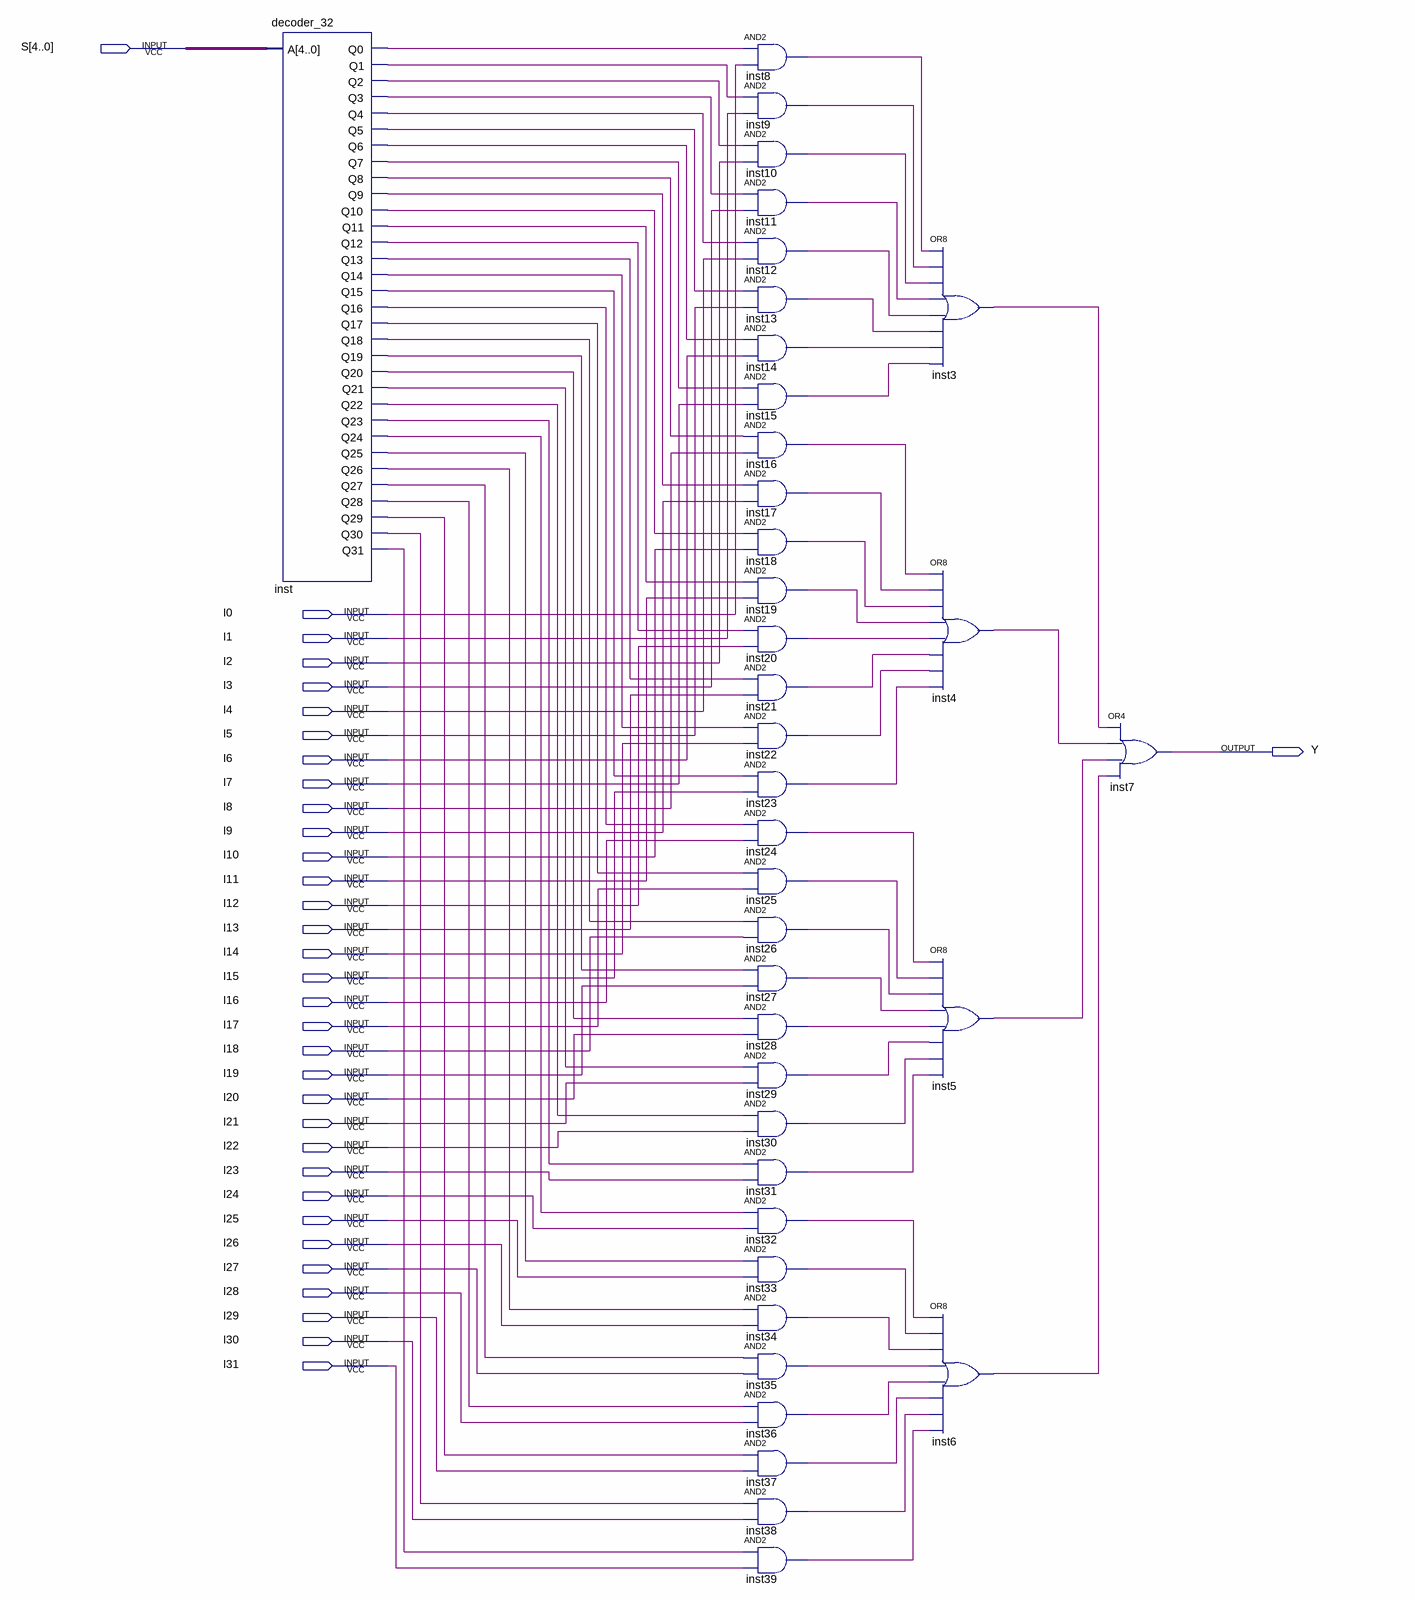
[diagram p0: schematic sheet]
// Quartus schematic MUX32.bdf as structural Verilog: 38 symbols, 34 pins
module MUX32 (
  input  [4:0] S,
  input  I0,
  input  I1,
  input  I2,
  input  I3,
  input  I4,
  input  I5,
  input  I6,
  input  I7,
  input  I8,
  input  I9,
  input  I10,
  input  I11,
  input  I12,
  input  I13,
  input  I14,
  input  I15,
  input  I16,
  input  I17,
  input  I18,
  input  I19,
  input  I20,
  input  I21,
  input  I22,
  input  I23,
  input  I24,
  input  I25,
  input  I26,
  input  I27,
  input  I28,
  input  I29,
  input  I30,
  input  I31,
  output Y
);

  wire inst3_out, inst4_out, inst5_out, inst6_out, inst8_out, inst9_out, inst10_out, inst11_out, inst12_out,
       inst13_out, inst14_out, inst15_out, inst16_out, inst17_out, inst18_out, inst19_out, inst20_out,
       inst21_out, inst22_out, inst23_out, inst24_out, inst25_out, inst26_out, inst27_out, inst28_out,
       inst29_out, inst30_out, inst31_out, inst32_out, inst33_out, inst34_out, inst35_out, inst36_out,
       inst37_out, inst38_out, inst39_out, inst_q0, inst_q1, inst_q2, inst_q3, inst_q4, inst_q5, inst_q6,
       inst_q7, inst_q8, inst_q9, inst_q10, inst_q11, inst_q12, inst_q13, inst_q14, inst_q15, inst_q16,
       inst_q17, inst_q18, inst_q19, inst_q20, inst_q21, inst_q22, inst_q23, inst_q24, inst_q25, inst_q26,
       inst_q27, inst_q28, inst_q29, inst_q30, inst_q31;

  decoder_32 inst (
    .A(S), .Q0(inst_q0), .Q1(inst_q1), .Q2(inst_q2), .Q3(inst_q3), .Q4(inst_q4), .Q5(inst_q5), .Q6(inst_q6),
    .Q7(inst_q7), .Q8(inst_q8), .Q9(inst_q9), .Q10(inst_q10), .Q11(inst_q11), .Q12(inst_q12), .Q13(inst_q13),
    .Q14(inst_q14), .Q15(inst_q15), .Q16(inst_q16), .Q17(inst_q17), .Q18(inst_q18), .Q19(inst_q19),
    .Q20(inst_q20), .Q21(inst_q21), .Q22(inst_q22), .Q23(inst_q23), .Q24(inst_q24), .Q25(inst_q25),
    .Q26(inst_q26), .Q27(inst_q27), .Q28(inst_q28), .Q29(inst_q29), .Q30(inst_q30), .Q31(inst_q31));
  and inst8 (inst8_out, inst_q0, I0);
  and inst9 (inst9_out, inst_q1, I1);
  and inst10 (inst10_out, inst_q2, I2);
  and inst11 (inst11_out, inst_q3, I3);
  and inst12 (inst12_out, inst_q4, I4);
  and inst13 (inst13_out, inst_q5, I5);
  and inst14 (inst14_out, inst_q6, I6);
  and inst15 (inst15_out, inst_q7, I7);
  and inst16 (inst16_out, inst_q8, I8);
  and inst17 (inst17_out, inst_q9, I9);
  and inst18 (inst18_out, inst_q10, I10);
  and inst19 (inst19_out, inst_q11, I11);
  and inst20 (inst20_out, inst_q12, I12);
  and inst21 (inst21_out, inst_q13, I13);
  and inst22 (inst22_out, inst_q14, I14);
  and inst23 (inst23_out, inst_q15, I15);
  and inst24 (inst24_out, inst_q16, I16);
  and inst25 (inst25_out, inst_q17, I17);
  and inst26 (inst26_out, inst_q18, I18);
  and inst27 (inst27_out, inst_q19, I19);
  and inst28 (inst28_out, inst_q20, I20);
  and inst29 (inst29_out, inst_q21, I21);
  and inst30 (inst30_out, inst_q22, I22);
  and inst31 (inst31_out, inst_q23, I23);
  and inst32 (inst32_out, inst_q24, I24);
  and inst33 (inst33_out, inst_q25, I25);
  and inst34 (inst34_out, inst_q26, I26);
  and inst35 (inst35_out, inst_q27, I27);
  and inst36 (inst36_out, inst_q28, I28);
  and inst37 (inst37_out, inst_q29, I29);
  and inst38 (inst38_out, inst_q30, I30);
  and inst39 (inst39_out, inst_q31, I31);
  or inst3 (inst3_out, inst8_out, inst9_out, inst10_out, inst11_out, inst12_out, inst13_out, inst14_out, inst15_out);
  or inst4 (inst4_out, inst16_out, inst17_out, inst18_out, inst19_out, inst20_out, inst21_out, inst22_out, inst23_out);
  or inst5 (inst5_out, inst24_out, inst25_out, inst26_out, inst27_out, inst28_out, inst29_out, inst30_out, inst31_out);
  or inst6 (inst6_out, inst32_out, inst33_out, inst34_out, inst35_out, inst36_out, inst37_out, inst38_out, inst39_out);
  or inst7 (Y, inst3_out, inst4_out, inst5_out, inst6_out);
endmodule
